# EAGLE design Adafruit AD849x_Thermo (EAGLE 6.4)
COMPANY: ADAFRUIT INDUSTRIES; DRAWN: KTOWN; REV: A
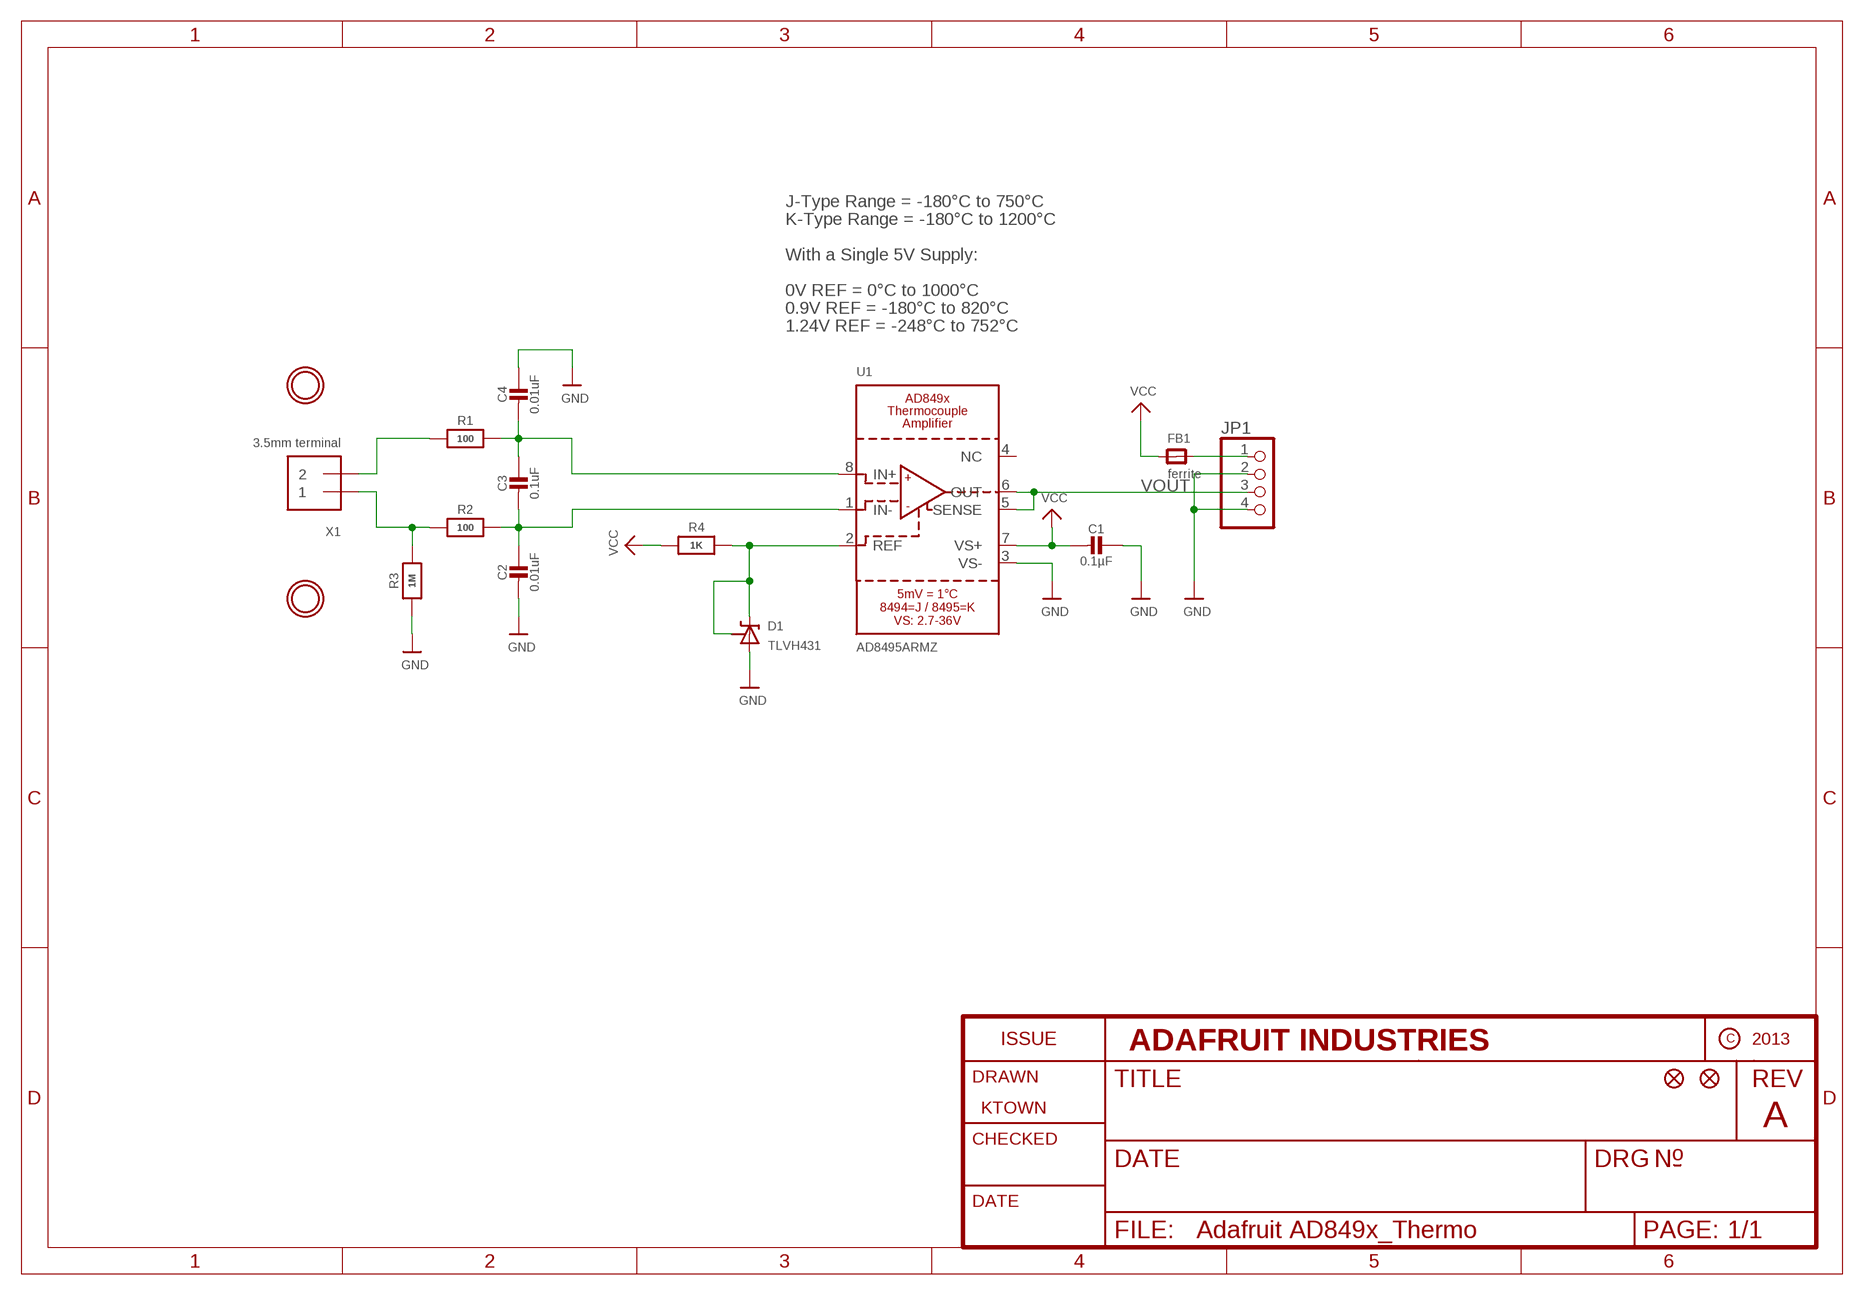
[diagram p0: schematic, sheet 1]

## Parts
C1  0.1µF  CAP_CERAMIC0805-NOOUTLINE  [0805-NO]
C2  0.01uF  CAP_CERAMIC0805-NOOUTLINE  [0805-NO]
C3  0.1uF  CAP_CERAMIC0805-NOOUTLINE  [0805-NO]
C4  0.01uF  CAP_CERAMIC0805-NOOUTLINE  [0805-NO]
D1  TLVH431  SHUNT-VREF  [SOT23-R]
FB1  ferrite  FERRITE0805  [0805]
FID1  FIDUCIAL""  [FIDUCIAL_1MM]
FID2  FIDUCIAL""  [FIDUCIAL_1MM]
JP1  HEADER-1X4ROUND  [1X04_ROUND]
R1  100  RESISTOR0805_NOOUTLINE  [0805-NO]
R2  100  RESISTOR0805_NOOUTLINE  [0805-NO]
R3  1M  RESISTOR0805_NOOUTLINE  [0805-NO]
R4  1K  RESISTOR0805_NOOUTLINE  [0805-NO]
U1  AD8495ARMZ  AD849X  [MSOP8_0.65MM]
U$11  MOUNTINGHOLE2.5  [MOUNTINGHOLE_2.5_PLATED]
U$12  MOUNTINGHOLE2.5  [MOUNTINGHOLE_2.5_PLATED]
X1  3.5mm terminal  TERMBLOCK_1X2  [TERMBLOCK_1X2-3.5MM]

## Nets
GND: C1.1 C2.2 C4.1 D1.3(A) JP1.2 JP1.4 R3.1 U1.3(VS-)
IN+: R1.1 X1.2
IN-: R2.1 R3.2 X1.1
N$1: D1.1(VREF) D1.2(C) R4.2 U1.2(REF)
N$2: C3.1 C4.2 R1.2 U1.8(IN+)
N$3: C2.1 C3.2 R2.2 U1.1(IN-)
N$4: FB1.2 JP1.1
VCC: C1.2 FB1.1 R4.1 U1.7(VS+)
VOUT: JP1.3 U1.5(SENSE) U1.6(OUT)
Unconnected: U1.4(NC)

## Notes on the sheet
- J-Type Range = -180°C to 750°C
- K-Type Range = -180°C to 1200°C
- With a Single 5V Supply:
- 0V REF = 0°C to 1000°C
- 0.9V REF = -180°C to 820°C
- 1.24V REF = -248°C to 752°C

## Library data of the parts
C1-C4 = microbuilder:CAP_CERAMIC: Ceramic Capacitors For new designs, use the packages preceded by an '_' character since they are more reliable: The following footprints should be used on most boards: _0402 - Standard footprint for regular board layouts _0603 - Standard footprint for regular board layouts _0805 - Standard footprint for regular board layouts _1206 - Standard footprint for regular board layouts For extremely tight-pitch boards where space is at a premium, the following 'micro-pitch' footprints can be used (smaller pads, no silkscreen outline, etc.): _0402MP - Micro-pitch footprint for very dense/compact boards _0603MP - Micro-pitch footprint for very dense/compact boards _0805MP - Micro-pitch footprint for very dense/compact boards _1206MP - Micro-pitch footprint for very dense/compact boards
D1 = microbuilder:SHUNT-VREF: Shunt Voltage Reference TS3431 - 1.24V Programmable Shunt Voltage Ref. - 1.24-24V, up to 0.25% accuracy, SOT23 (0.25% = Digikey: 497-4637-1-ND) TLVH431 - 1.24V Programmable Shunt Voltage Ref - 1.24-18V, up to 0.50% accuracy, SOT23 (0.50% = Digikey: 296-17687-1-ND See: http://www.ti.com/lit/an/slva445/slva445.pdf
FB1 = microbuilder:FERRITE: Ferrite Bead 0603 MMZ1608B121C - 120 Ohm @ 100MHz, 600mA, 0.15 Ohm DC Resistance - Digikey: 445-2164-1-ND BK1608HW121-T - 120 Ohm, 600mA Ferrite Chip - Digikey: 587-1876-2-ND 0805 HZ0805B272R-10 - 2.7K Ohm @ 100MHz, 200mA, 0.8 Ohm DC Resistance - Digikey: 240-2504-1-ND (see also Murata BLM21BD272SN1L) MMZ2012Y152B - 1.5K Ohm @ 100MHz, 500mA, 0.4 Ohm DC Resistance - Digikey: 445-1560-1-ND - Mainly for high frequency (80-400MHz) MMZ2012R102A - 1K Ohm @ 100MHz, 500mA, 0.3 Ohm DC Resistance - Digikey: 445-1555-2-ND - More general purpose (10-200MHz)
FID1 FID2 = microbuilder:FIDUCIAL: Fiducial Alignment Points Various fiducial points for machine vision alignment.; BOM: EXCLUDE
JP1 = microbuilder:HEADER-1X4: PIN HEADER
R1-R4 = microbuilder:RESISTOR: Resistors For new designs, use the packages preceded by an '_' character since they are more reliable: The following footprints should be used on most boards: _0402 - Standard footprint for regular board layouts _0603 - Standard footprint for regular board layouts _0805 - Standard footprint for regular board layouts _1206 - Standard footprint for regular board layouts For extremely tight-pitch boards where space is at a premium, the following 'micro-pitch' footprints can be used (smaller pads, no silkscreen outline, etc.): _0402MP - Micro-pitch footprint for very dense/compact boards _0603MP - Micro-pitch footprint for very dense/compact boards _0805MP - Micro-pitch footprint for very dense/compact boards _1206MP - Micro-pitch footprint for very dense/compact boards
U1 = microbuilder:AD849X: AD8494/8495 - Precision Thermocouple Amplifier with Cold Junction Compensation For J-Type Thermocouples use AD8494, For K-Type use AD8495 5 mV/°C thermometer output Single Supply: 2.7 V to 36 V Dual Supply: ±2.7 V to ±18 V
U$11 U$12 = microbuilder:MOUNTINGHOLE: Mounting Hole For #2 screws (0.086"/2.18mm width, 0.094"/2.4mm hole) use 2.5mm; BOM: EXCLUDE
X1 = microbuilder:TERMBLOCK_1X2: 3.5mm Terminal block http://www.ladyada.net/library/pcb/eaglelibrary.html

## Board
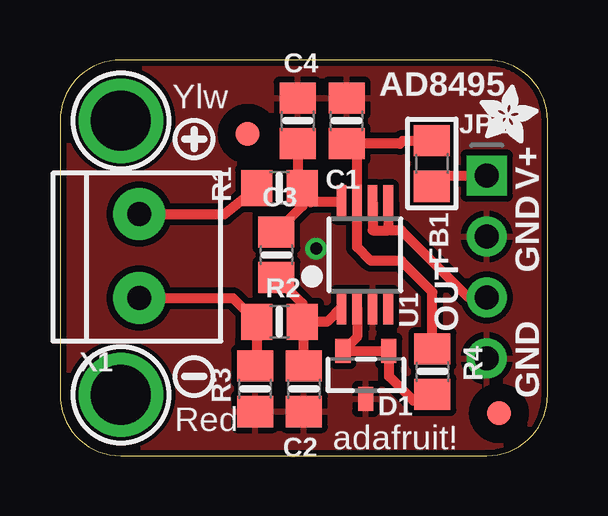
[diagram p1: board, top side]
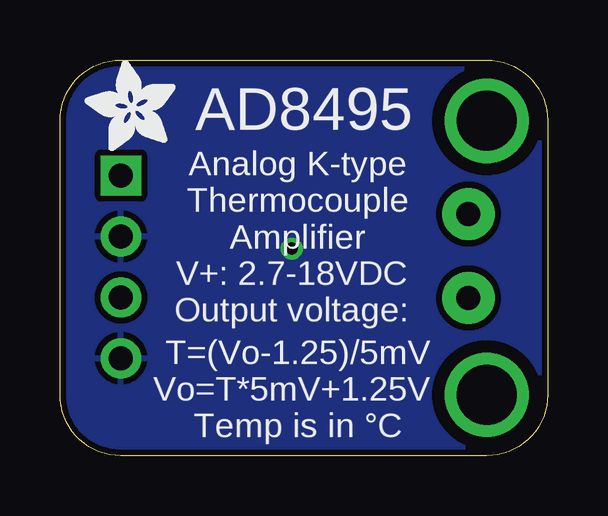
[diagram p2: board, bottom side, seen from below]

Size 20.32 x 16.51 mm. Coordinates in mm from the lower left corner, seen from the top.
Outline: 20.32,2.54 20.32,13.97 arc90 17.78,16.51 2.54,16.51 arc90 0,13.97 0,2.54 arc90 2.54,0 17.78,0 arc90 20.32,2.54
Copper layers (1*16): Top 0.035mm / dielectric 1.5mm / Bottom 0.035mm
Design rules "adafruit": minimum track width 8mil, minimum drill 15.5mil, track to track 8mil, track to pad 8mil, pad to pad 8mil, via to via 8mil, smd to smd 8mil, copper to edge 10mil, drill to drill 8mil, minimum pad ring 10mil, minimum via ring 8mil, stop-mask expansion 4mil, vias tented up to drill 20mil, thermal gap 10mil

### Footprints (pad centres in the part's own frame; a part is rotated, then mirrored left to right if it is on the bottom)
0805-NO = smd 1.3 x 1.5: 1 -0.95,0; 2 0.95,0
SOT23-R = smd 0.635 x 1.016: 1 -0.95,-1; 2 0.95,-1; 3 0,1
0805 = smd 1.3 x 1.5: 1 -0.95,0; 2 0.95,0
FIDUCIAL_1MM = smd 1 x 1: 1 0,0
1X04_ROUND = drill 1 pad 1.676 square: 1 -3.81,0 | drill 1 pad 1.676: 2 -1.27,0; 3 1.27,0; 4 3.81,0
MSOP8_0.65MM = smd 0.4 x 1.4: 1 -0.975,-2.2; 2 -0.325,-2.2; 3 0.325,-2.2; 4 0.975,-2.2; 5 0.975,2.2; 6 0.325,2.2; 7 -0.325,2.2; 8 -0.975,2.2
MOUNTINGHOLE_2.5_PLATED = drill 2.5 pad 3.2: P$1 0,0
TERMBLOCK_1X2-3.5MM = drill 1 pad 2.184: 1 1.8,0; 2 -1.7,0

### Placement (x,y rotation side)
C1  11.94,13.97 270 top
C2  10.16,2.79 270 top
C3  9.02,8.38 270 top
C4  9.91,13.97 270 top
D1  12.74,3.38 180 top
FB1  15.49,12.19 270 top
FID1  18.29,1.78 0 top
FID2  7.82,13.43 0 top
JP1  17.78,7.87 270 top
R1  9.14,11.18 0 top
R2  9.14,5.59 0 top
R3  8.13,2.79 90 top
R4  15.52,3.51 270 top
U1  12.7,8.38 0 top
U$8  [SYMBOL_PLUS]  5.59,13.21 0 top
U$9  [SYMBOL_MINUS]  5.59,3.3 0 top
U$10  [ADAFRUIT_2.5MM]  17.5,13.04 0 top
U$11  2.54,13.97 0 top
U$12  2.54,2.54 0 top
U$13  [ADAFRUIT_3.5MM]  15.49,12.7 90 bottom
X1  3.3,8.38 270 top

### Tracks (layer width: path | path; a pad name or v marks a point on that pad's centre or on a via)
GND  (via drill 0.5)
  other vias: 10.67,8.64
  pour Top (isolate 0.254): 0,16.54 20.21,16.54 20.21,0 0,0
  pour Bottom (isolate 0.254): 0,16.54 20.21,16.54 20.21,0 0,0
IN+
  Top 0.406: X1.2 6.85,10.08 R1.1
IN-
  Top 0.406: X1.1 7.2,6.58 R2.1 8.19,3.81 R3.2
N$1
  Top 0.406: R4.2 14.71,2.31 13.72,3.3 13.72,4.1 D1.1 D1.2 12.38,4.96 U1.2
N$2
  Top 0.406: R1.2 10.09,10.41 C3.1 | U1.8 10.43,10.58 R1.2 | C4.2 9.91,11.24 R1.2
N$3
  Top 0.406: C2.1 10.16,5.52 R2.2 | C3.2 10.09,6.36 R2.2 | U1.1 11.13,5.59 R2.2
N$4
  Top 0.406: FB1.2 15.56,11.68 JP1.1
VCC
  Top 0.406: R4.1 15.52,6.83 14.22,8.13 12.95,8.13 12.38,8.71 U1.7 12.38,12.58 C1.2 14.16,13.02 14.28,13.14 FB1.1
VOUT
  Top 0.406: U1.6 13.03,9.4 13.68,9.4 | U1.5 13.68,9.4 | JP1.3 17.02,6.6 14.22,9.4 13.68,9.4

### Text on the board
tPlace: AD8495 | Ylw | V+ | GND | OUT | GND | Red | adafruit!
bPlace: AD8495 | Analog K-type / Thermocouple / Amplifier | V+: 2.7-18VDC | Output voltage: | T=(Vo-1.25)/5mV | Vo=T*5mV+1.25V | Temp is in °C